# Altium schematic sheet UltrazohmConnectors.SchDoc
size A4; Author: Timo Wilfling; Address1: TH Nürnberg; Address2: Georg Simon Ohm; Address3: Kesslerplatz 10; Address4: 90489 Nürnberg; SheetNumber: 4; SheetTotal: 8
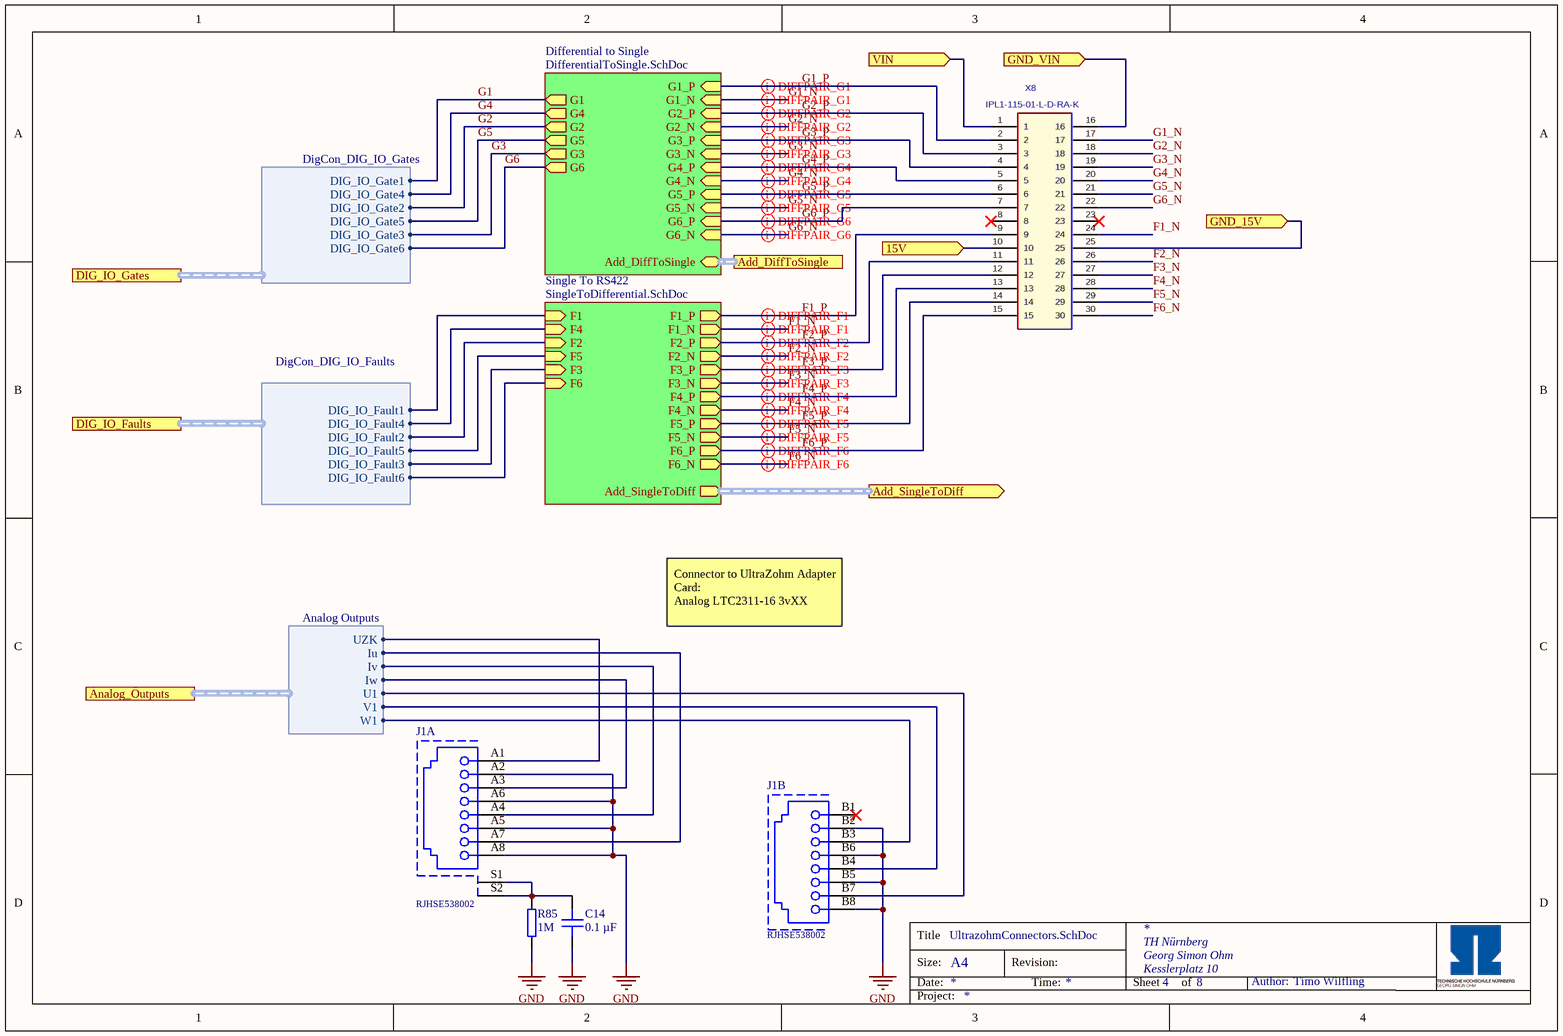
[diagram p0: UltrazohmConnectors.SchDoc]

## Parts
C14  0.1 µF  [C_0805]
J1  RJHSE538002  [RJHSE-5380-02]  (parts A,B of 2)
R85  1M  [RES 0603_1608]
X8  IPL1-115-01-L-D-RA-K  [IPL1-115-01-XX-D-RA]

## Sub-sheets
Differential to Single = DifferentialToSingle.SchDoc: G1 (out), G4 (out), G2 (out), G5 (out), G3 (out), G6 (out), G1_N (in), G2_P (in), G2_N (in), G3_P (in), G3_N (in), G4_P (in), G4_N (in), G1_P (in), G5_P (in), G5_N (in), G6_P (in), G6_N (in), Add_DiffToSingle (bidir, harness Add_DiffToSingle)
Single To RS422 = SingleToDifferential.SchDoc: F1 (in), F4 (in), F2 (in), F5 (in), F3 (in), F6 (in), F1_P (out), F1_N (out), F2_P (out), F2_N (out), F3_P (out), F3_N (out), F4_P (out), F4_N (out), F5_P (out), F5_N (out), F6_P (out), F6_N (out), Add_SingleToDiff (out, harness Add_SingleToDiff)

## Ports
15V (in), Add_DiffToSingle (harness Add_DiffToSingle), Add_SingleToDiff (out, harness Add_SingleToDiff), Analog_Outputs (harness Analog Outputs), DIG_IO_Faults (harness DigCon_DIG_IO_Faults), DIG_IO_Gates (harness DigCon_DIG_IO_Gates), GND_15V (in), GND_VIN (in), VIN (in)

## Harnesses
DigCon_DIG_IO_Gates: DIG_IO_Gate1, DIG_IO_Gate4, DIG_IO_Gate2, DIG_IO_Gate5, DIG_IO_Gate3, DIG_IO_Gate6
Analog Outputs: UZK, Iu, Iv, U1, Iw, V1, W1
DigCon_DIG_IO_Faults: DIG_IO_Fault1, DIG_IO_Fault4, DIG_IO_Fault2, DIG_IO_Fault5, DIG_IO_Fault3, DIG_IO_Fault6

## Nets
GND: C14.1 J1.A2 J1.A5 J1.A6 J1.A8 J1.B2 J1.B5 J1.B6 J1.B8 R85.1
15V: X8.10 ; port 15V
F1_N: X8.24 ; sheet Single To RS422/F1_N
F1_P: X8.9 ; sheet Single To RS422/F1_P
F2_N: X8.26 ; sheet Single To RS422/F2_N
F2_P: X8.11 ; sheet Single To RS422/F2_P
F3_N: X8.27 ; sheet Single To RS422/F3_N
F3_P: X8.12 ; sheet Single To RS422/F3_P
F4_N: X8.28 ; sheet Single To RS422/F4_N
F4_P: X8.13 ; sheet Single To RS422/F4_P
F5_N: X8.29 ; sheet Single To RS422/F5_N
F5_P: X8.14 ; sheet Single To RS422/F5_P
F6_N: X8.30 ; sheet Single To RS422/F6_N
F6_P: X8.15 ; sheet Single To RS422/F6_P
G1: sheet Differential to Single/G1, port DIG_IO_Gates.DIG_IO_Gate1
G1_N: X8.17 ; sheet Differential to Single/G1_N
G1_P: X8.2 ; sheet Differential to Single/G1_P
G2: sheet Differential to Single/G2, port DIG_IO_Gates.DIG_IO_Gate2
G2_N: X8.18 ; sheet Differential to Single/G2_N
G2_P: X8.3 ; sheet Differential to Single/G2_P
G3: sheet Differential to Single/G3, port DIG_IO_Gates.DIG_IO_Gate3
G3_N: X8.19 ; sheet Differential to Single/G3_N
G3_P: X8.4 ; sheet Differential to Single/G3_P
G4: sheet Differential to Single/G4, port DIG_IO_Gates.DIG_IO_Gate4
G4_N: X8.20 ; sheet Differential to Single/G4_N
G4_P: X8.5 ; sheet Differential to Single/G4_P
G5: sheet Differential to Single/G5, port DIG_IO_Gates.DIG_IO_Gate5
G5_N: X8.21 ; sheet Differential to Single/G5_N
G5_P: X8.6 ; sheet Differential to Single/G5_P
G6: sheet Differential to Single/G6, port DIG_IO_Gates.DIG_IO_Gate6
G6_N: X8.22 ; sheet Differential to Single/G6_N
G6_P: X8.7 ; sheet Differential to Single/G6_P
GND_15V: X8.25 ; port GND_15V
GND_VIN: X8.16 ; port GND_VIN
VIN: X8.1 ; port VIN
NetC14_2: C14.2 J1.S1 J1.S2 R85.2
NetJ1_A1: J1.A1 ; port Analog_Outputs.UZK
NetJ1_A3: J1.A3 ; port Analog_Outputs.Iw
NetJ1_A4: J1.A4 ; port Analog_Outputs.Iv
NetJ1_A7: J1.A7 ; port Analog_Outputs.Iu
NetJ1_B3: J1.B3 ; port Analog_Outputs.W1
NetJ1_B4: J1.B4 ; port Analog_Outputs.V1
NetJ1_B7: J1.B7 ; port Analog_Outputs.U1
(unnamed): sheet Single To RS422/F1, port DIG_IO_Faults.DIG_IO_Fault1
(unnamed): sheet Single To RS422/F4, port DIG_IO_Faults.DIG_IO_Fault4
(unnamed): sheet Single To RS422/F2, port DIG_IO_Faults.DIG_IO_Fault2
(unnamed): sheet Single To RS422/F5, port DIG_IO_Faults.DIG_IO_Fault5
(unnamed): sheet Single To RS422/F3, port DIG_IO_Faults.DIG_IO_Fault3
(unnamed): sheet Single To RS422/F6, port DIG_IO_Faults.DIG_IO_Fault6

Not connected (* = marked no-connect by the designer): J1 B1*; X8 8* 23*

## Buses and harness runs
harness port Add_DiffToSingle = sheet Differential to Single/Add_DiffToSingle
harness port Add_SingleToDiff = sheet Single To RS422/Add_SingleToDiff

## Layout directives
differential pair; rule Differential Pairs Routing [Pref Gap = 10mil    Min Gap  = 5mil    Max Gap  = 10milPref Width = 15mil    Min Width  = 3.957mil    Max Width  = 15mil]: G1_P
differential pair: F1_N, F1_P, F2_N, F2_P, F3_N, F3_P, F4_N, F4_P, F5_N, F5_P, F6_N, F6_P, G1_N, G2_N, G2_P, G3_N, G3_P, G4_N, G4_P, G5_N, G5_P, G6_N, G6_P

## Notes on the sheet
- Connector to UltraZohm Adapter Card:
  Analog LTC2311-16 3vXX
- Title
- Size:
- Date:
- A4
- Revision:
- Time:
- Sheet
- of
- Author:
- Project:

## Library data of the parts
C14 = C0805C104J5RECTU: Capacitor 0805, 50 VDC, 0.1 µF, X7R; Manufacturer: KEMET; Tolerance: 5 %; Voltage Rating: 50 VDC; Created from: MGremer; Manufacturer Part Number: C0805C104J5RECTU; PartID: 17; Created On: 20.12.2020 13:54:13; ComponentLink1Description: Datasheet; ComponentLink1URL: https://www.mouser.de/datasheet/2/212/KEM_C1002_X7R_SMD-1102033.pdf; Component Type: Capacitor 0805; Device Package: 0805; Last Updated: 20.12.2020 16:34:30; Mounting Type: SMD; Operating Temperature: -55 - 125°C; Series: SMD Comm X7R; Supplier 1: Mouser; Supplier Part Number 1: 80-C0805C104J5RECTU; Type: Capacitor; Value: 0.1 µF; Live Cycle Status: 1; Stock number: Labor SMD Container
J1 = RJHSE538002: CAT5, RJ45 Connector, 1x2; Manufacturer: Amphenol; Created from: MGremer; Manufacturer Part Number: RJHSE538002; PartID: 4; Created On: 22.02.2021 16:43:38; ComponentLink1Description: Datasheet; ComponentLink1URL: https://www.farnell.com/cad/2360382.pdf; Component Type: RJ45 Connector; Device Package: RJ45; Last Updated: 22.02.2021 16:43:38; Mounting Type: THT; Series: RJHSE; Supplier 1: Farnell; Supplier Part Number 1: 1860605; Type: RJ45 Connector; Live Cycle Status: 1; Stock number: not stored
R85 = RK73B1JTTDD105J: SMD resistor E24 series; Manufacturer: KOA Speer; Tolerance: 5%; Created from: MGremer; Manufacturer Part Number: RK73B1JTTDD105J; PartID: 146; Created On: 14.12.2020 16:17:14; ComponentLink1Description: Datasheet; ComponentLink1URL: https://www.mouser.de/datasheet/2/219/RK73B-1825463.pdf; Component Type: SMD resistor; Device Package: 0603; Last Updated: 02.03.2021 14:07:32; Mounting Type: SMD; Supplier 1: Mouser; Supplier Part Number 1: 660-RK73B1JTTDD105J; Type: Resistor; Value: 1M; Live Cycle Status: 1; Stock number: Labor SMD Container
X8 = IPL1-115-01-L-D-RA-K: Terminal Assembly, Double Row, Right Angle, Thru-Hole, 2.54 mm x 2.54 mm Pitch, 30 Pins; Manufacturer: SAMTEC; Created from: TWendt; Number of positions: 30; Manufacturer Part Number: IPL1-115-01-L-D-RA-K; PartID: 34; Created On: 12.02.2021 15:31:18; ComponentLink1Description: Homepage; ComponentLink1URL: https://www.samtec.com/products/ipl1; Component Type: Samtec Connector; Device Package: Connector; Last Updated: 15.02.2021 10:07:42; Supplier 1: SAMTEC; Supplier Part Number 1: IPL1-115-01-L-D-RA-K; Type: Connector; Live Cycle Status: 1; Number of rows: 2; Stock number: not stored